# Altium schematic sheet temp1.SchDoc
size A
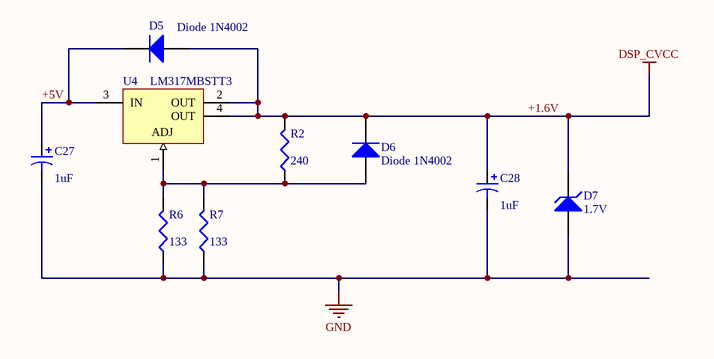
[diagram p0: temp1.SchDoc]

## Parts
C27  value 1uF  [1812]  (hidden comment: Cap Pol3)
C28  value 1uF  [1812]  (hidden comment: Cap Pol3)
D5  Diode 1N4002  [DO-41]
D6  Diode 1N4002  [DO-41]
D7  1.7V  [DL-41]
R2  value 240  [3225[1210]]  (hidden comment: Res3)
R6  value 133  [3225[1210]]  (hidden comment: Res3)
R7  value 133  [3225[1210]]  (hidden comment: Res3)
U4  LM317MBSTT3  [318E-04]

## Nets
+1.6V: C28.1 D5.1(A) D6.2(K) D7.2(K) R2.2 U4.2(OUT) U4.4(OUT)  [also labelled DSP_CVCC]
GND: C27.2 C28.2 D7.1(A) R6.1 R7.1
+5V: C27.1 D5.2(K) U4.3(IN)
NetD6_1: D6.1(A) R2.1 R6.2 R7.2 U4.1(ADJ)

## Library data of the parts
C27 C28 = Cap Pol3: Polarized Capacitor (Surface Mount); Published: 8-Jun-2000; LatestRevisionDate: 17-Jul-2002; LatestRevisionNote: Re-released for DXP Platform.; PackageReference: C0805; Publisher: Altium Limited
D5 D6 = Diode 1N4002: 1 Amp General Purpose Rectifier; Published: 8-Jun-2000; LatestRevisionDate: 17-Jul-2002; LatestRevisionNote: Re-released for DXP Platform.; DatasheetDocument: 1998; PackageDocument: Aug-1999; PackageReference: DO-41; Publisher: Altium Limited; Code_JEDEC: DO-204-AL; ComponentLink1Description: Manufacturer Link; ComponentLink1URL: http://www.fairchildsemi.com/; ComponentLink2Description: Datasheet; ComponentLink2URL: http://www.fairchildsemi.com/ds/1N%2F1N4001.pdf
D7 = DL4742A: Silicon Zener Diode; Published: 8-Jun-2000; LatestRevisionDate: 19-Mar-2004; LatestRevisionNote: Silkscreen size reduced.; PackageReference: DL-41; Publisher: Altium Limited; Code_IPC: SOD-87/MLL41; ComponentLink1Description: Manufacturer Link; ComponentLink1URL: http://www.vishay.com/
R2 R6 R7 = Res3: Resistor; Published: 8-Jun-2000; LatestRevisionDate: 04-Mar-2005; LatestRevisionNote: PCB Footprint replaced.; PackageReference: J1-0603; Publisher: Altium Limited
U4 = LM317MBSTT3: Three-Terminal Adjustable Output Positive Voltage Regulator; Note: Pin 2 is electrically connected to Pin 4 (TAB); Published: 15-Apr-2002; DatasheetVersion: Nov-1999; PackageVersion: Nov-1999; PackageReference: 318E-04; Publisher: Altium Limited; PackageDescription: SOT-223/SC-73; 4 Leads; Body 6.7 x 7.3 mm, inc. leads (LxW max); ComponentLink1Description: Manufacturer Link; ComponentLink1URL: http://www.onsemi.com/site/products/taxonomy/0,4438,503,00.html; ComponentLink2Description: Datasheet; ComponentLink2URL: http://www.onsemi.com/pub/Collateral/LM317M-D.PDF